# EAGLE design crystalis (EAGLE 7.3.0)
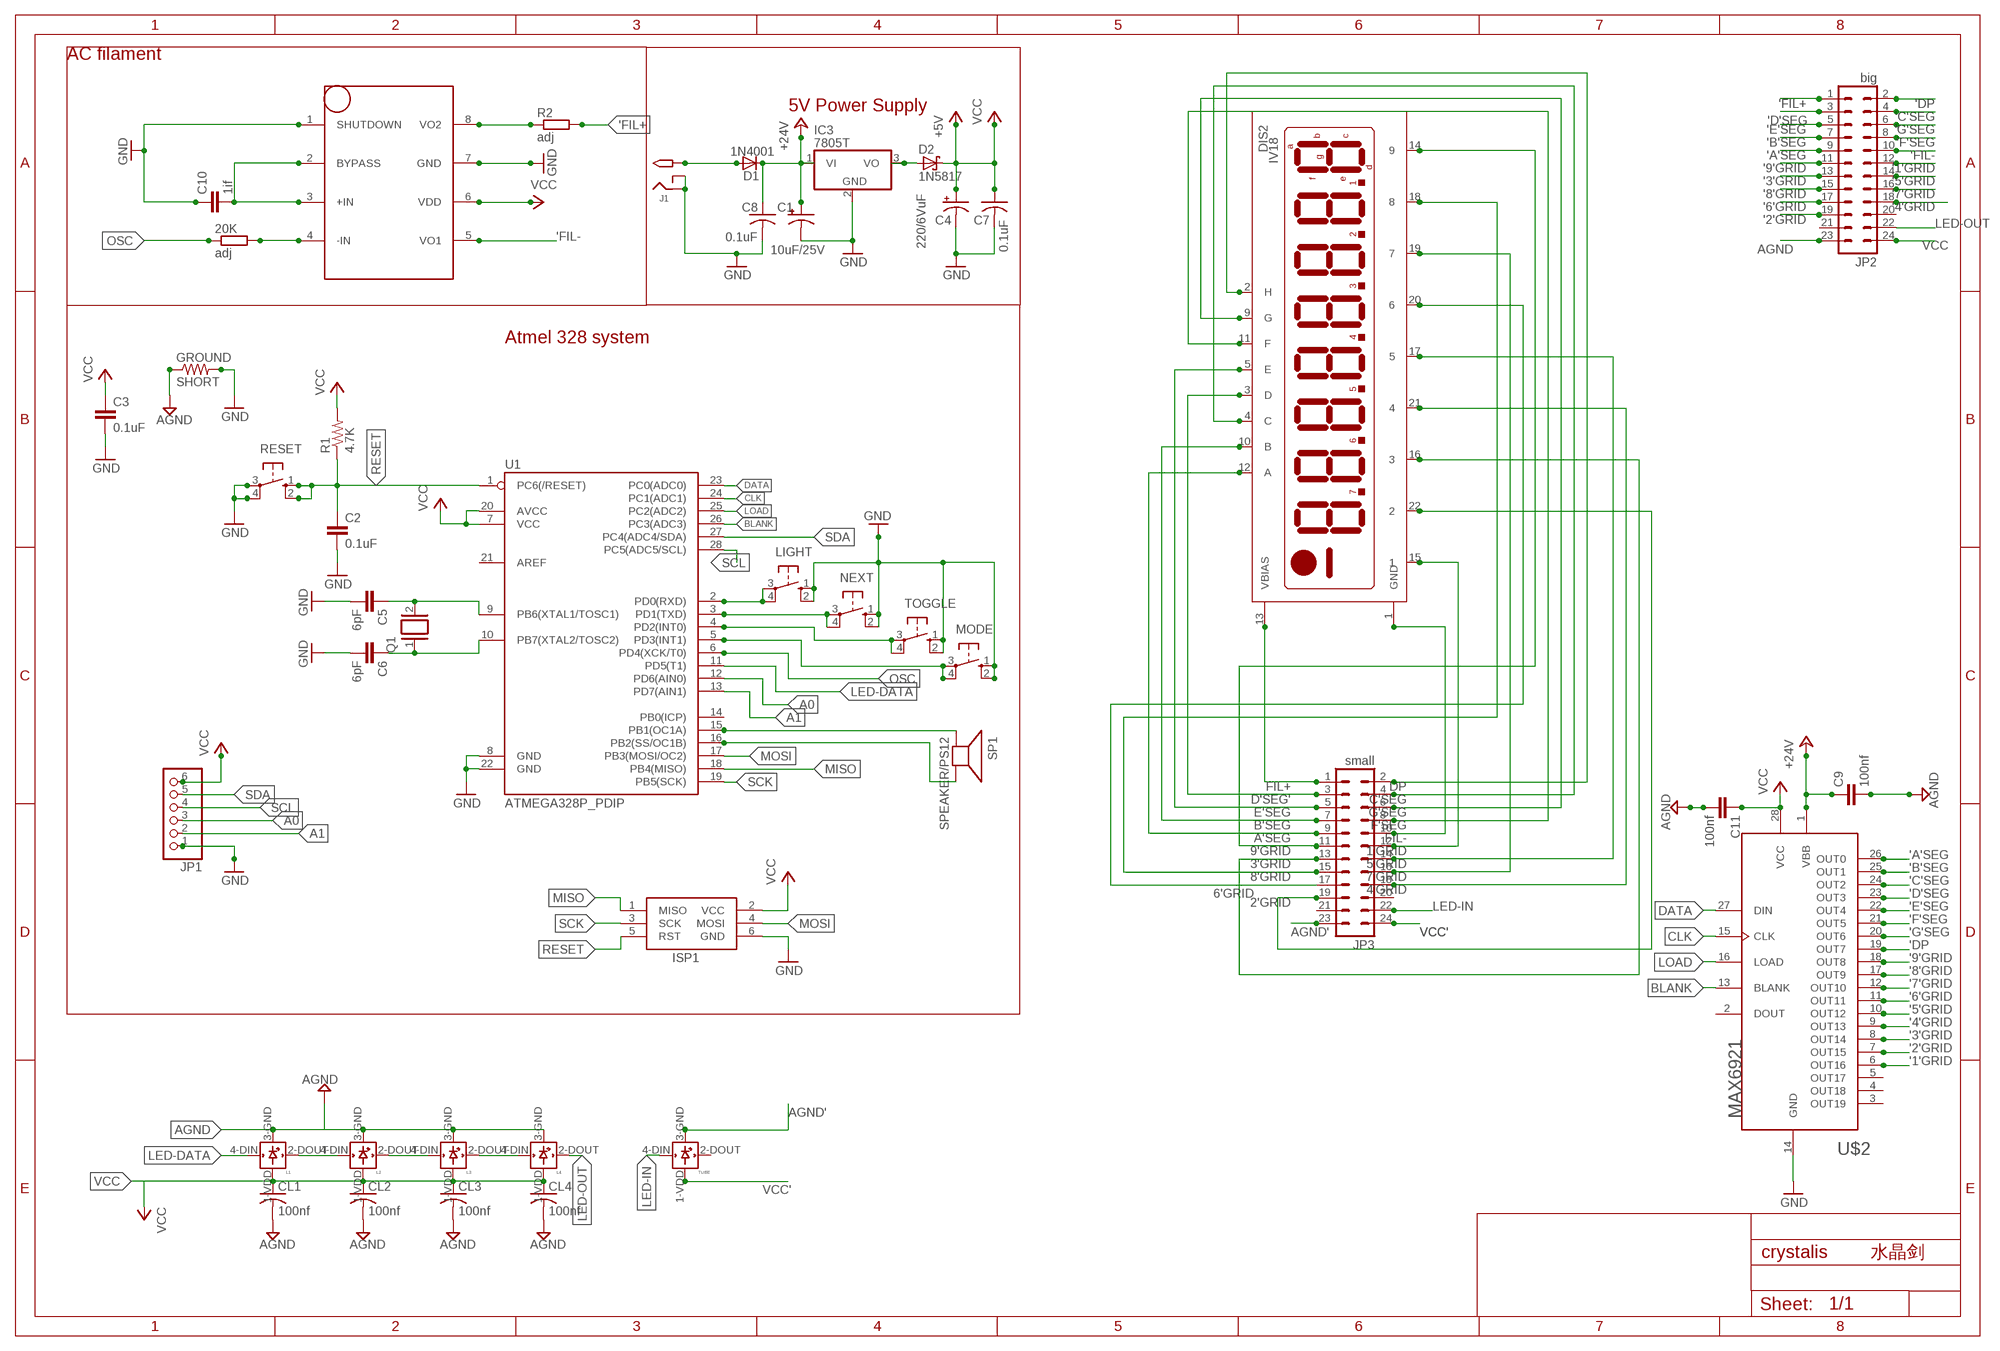
[diagram p0: schematic, sheet 1]

## Parts
20K  adj  R-EU_0207/5V  [0207/5V]
C1  10uF/25V  CPOL-USE2.5-6  [E2,5-6]
C2  0.1uF  C-EU025-025X050  [C025-025X050]
C3  0.1uF  C-EU025-025X050  [C025-025X050]
C4  220/6VuF  CPOL-USE2.5-6  [E2,5-6]
C5  6pF  C-EU025-024X044  [C025-024X044]
C6  6pF  C-EU025-024X044  [C025-024X044]
C7  0.1uF  C-US025-025X050  [C025-025X050]
C8  0.1uF  C-US025-025X050  [C025-025X050]
C9  100nf  C-EU050-030X075  [C050-030X075]
C10  1if  C-EU025-030X050  [C025-030X050]
C11  100nf  C-EU050-030X075  [C050-030X075]
CL1  100nf  C-USC1206  [C1206]
CL2  100nf  C-USC1206  [C1206]
CL3  100nf  C-USC1206  [C1206]
CL4  100nf  C-USC1206  [C1206]
D1  1N4001  1N4004  [DO41-10]
D2  1N5817  SCHOTTKY-DIODEDO41  [DO41-10]
DIS2  IV18  [IV18]
GROUND  SHORT  R-US_M1206  [M1206]
IC3  7805T  [TO220H]
ISP1  AVRISP-6  [AVRISP]
J1  2.1MMJACK  [PJ-102A]
JP1  PINHD-1X6  [1X06]
JP2  big  MA12-2  [MA12-2]
JP3  small  MA12-2  [MA12-2]
L1  WS2812B  [WS2812B]
L2  WS2812B  [WS2812B]
L3  WS2812B  [WS2812B]
L4  WS2812B  [WS2812B]
LIGHT  40-XX  [B3F-40XX]
MODE  40-XX  [B3F-40XX]
NEXT  40-XX  [B3F-40XX]
Q1  XTAL/S  [QS]
R1  4.7K  R-US_0309/12  [0309/12]
R2  adj  R-EU_0207/5V  [0207/5V]
RESET  10-XX  [B3F-10XX]
SP1  SPEAKER/PS12  [PS12]
TOGGLE  40-XX  [B3F-40XX]
TUBE  WS2812B  [WS2812B]
U1  ATMEGA328P_PDIP  [DIL28-3]
U$1  LM4871  [SO08]
U$2  MAX6921  [PLCC-S28]

## Nets
1'GRID: DIS2.15 JP3.12
2'GRID: DIS2.22 JP3.19
3'GRID: DIS2.16 JP3.13
4'GRID: DIS2.21 JP3.18
5'GRID: DIS2.17 JP3.14
6'GRID: DIS2.20 JP3.17
7'GRID: DIS2.19 JP3.16
8'GRID: DIS2.18 JP3.15
9'GRID: DIS2.14 JP3.11
'1'GRID: JP2.12 U$2.6(OUT16)
'2'GRID: JP2.19 U$2.7(OUT15)
'3'GRID: JP2.13 U$2.8(OUT14)
'4'GRID: JP2.18 U$2.9(OUT13)
'5'GRID: JP2.14 U$2.10(OUT12)
'6'GRID: JP2.17 U$2.11(OUT11)
'7'GRID: JP2.16 U$2.12(OUT10)
'8'GRID: JP2.15 U$2.17(OUT9)
'9'GRID: JP2.11 U$2.18(OUT8)
'A'SEG: JP2.9 U$2.26(OUT0)
'B'SEG: JP2.7 U$2.25(OUT1)
'C'SEG: JP2.4 U$2.24(OUT2)
'D'SEG: JP2.3 U$2.23(OUT3)
'DP: JP2.2 U$2.19(OUT7)
'E'SEG: JP2.5 U$2.22(OUT4)
'F'SEG: JP2.8 U$2.21(OUT5)
'FIL+: JP2.1 R2.2
'FIL-: JP2.10 U$1.5(VO1)
'G'SEG: JP2.6 U$2.20(OUT6)
+24V: C1.+ C8.1 C9.1 D1.C IC3.1(VI) U$2.1(VBB)
A0: JP1.3 U1.12(PD6(AIN0))
A1: JP1.2 U1.13(PD7(AIN1))
A'SEG: DIS2.12(A) JP3.9
AGND: C9.2 C11.2 CL1.2 CL2.2 CL3.2 CL4.2 GROUND.1 JP2.23 L1.3-GND(GND) L2.3-GND(GND) L3.3-GND(GND) L4.3-GND(GND)
AGND': JP3.23 TUBE.3-GND(GND)
B'SEG: DIS2.10(B) JP3.7
BLANK: U1.26(PC3(ADC3)) U$2.13(BLANK)
C'SEG: DIS2.4(C) JP3.4
CLK: U1.24(PC1(ADC1)) U$2.15(CLK)
D'SEG': DIS2.3(D) JP3.3
DATA: U1.23(PC0(ADC0)) U$2.27(DIN)
DP: DIS2.2(H) JP3.2
E'SEG: DIS2.5(E) JP3.5
F'SEG: DIS2.11(F) JP3.8
FIL+: DIS2.13(VBIAS) JP3.1
FIL-: DIS2.1(GND) JP3.10
G'SEG: DIS2.9(G) JP3.6
GND: C1.- C2.2 C3.2 C4.- C5.2 C6.2 C7.2 C8.2 C10.1 GROUND.2 IC3.2(GND) ISP1.6(GND) J1.RING J1.RING_SW JP1.1 LIGHT.1(S) LIGHT.2(S1) MODE.1(S) MODE.2(S1) NEXT.1(S) NEXT.2(S1) RESET.3(P) RESET.4(P1) TOGGLE.1(S) TOGGLE.2(S1) U1.8(GND) U1.22(GND) U$1.1(SHUTDOWN) U$1.7(GND) U$2.14(GND)
LED-DATA: L1.4-DIN(DIN) U1.11(PD5(T1))
LED-IN: JP3.22 TUBE.4-DIN(DIN)
LED-OUT: JP2.22 L4.2-DOUT(DOUT)
LOAD: U1.25(PC2(ADC2)) U$2.16(LOAD)
MISO: ISP1.1(MISO) U1.18(PB4(MISO))
MOSI: ISP1.4(MOSI) U1.17(PB3(MOSI/OC2))
N$2: MODE.3(P) MODE.4(P1) U1.5(PD3(INT1))
N$4: D1.A J1.TIP
N$5: 20K.2 U$1.4(-IN)
N$6: R2.1 U$1.8(VO2)
N$7: C10.2 U$1.2(BYPASS) U$1.3(+IN)
N$8: LIGHT.3(P) LIGHT.4(P1) U1.2(PD0(RXD))
N$9: C5.1 Q1.2 U1.9(PB6(XTAL1/TOSC1))
N$10: NEXT.3(P) NEXT.4(P1) U1.3(PD1(TXD))
N$11: TOGGLE.3(P) TOGGLE.4(P1) U1.4(PD2(INT0))
N$12: SP1.P$1(+) U1.15(PB1(OC1A))
N$13: C6.1 Q1.1 U1.10(PB7(XTAL2/TOSC2))
N$14: SP1.P$2(-) U1.16(PB2(SS/OC1B))
N$53: D2.A IC3.3(VO)
N$158: L1.2-DOUT(DOUT) L2.4-DIN(DIN)
N$179: L2.2-DOUT(DOUT) L3.4-DIN(DIN)
N$180: L3.2-DOUT(DOUT) L4.4-DIN(DIN)
OSC: 20K.1 U1.6(PD4(XCK/T0))
RESET: C2.1 ISP1.5(RST) R1.1 RESET.1(S) RESET.2(S1) U1.1(PC6(/RESET))
SCK: ISP1.3(SCK) U1.19(PB5(SCK))
SCL: JP1.4 U1.28(PC5(ADC5/SCL))
SDA: JP1.5 U1.27(PC4(ADC4/SDA))
VCC: C3.1 C4.+ C7.1 C11.1 CL1.1 CL2.1 CL3.1 CL4.1 D2.C ISP1.2(VCC) JP1.6 JP2.24 L1.1-VDD(VDD) L2.1-VDD(VDD) L3.1-VDD(VDD) L4.1-VDD(VDD) R1.2 U1.7(VCC) U1.20(AVCC) U$1.6(VDD) U$2.28(VCC) ; supply symbol labelled +5V
VCC': JP3.24 TUBE.1-VDD(VDD)
Unconnected: JP2.20 JP2.21 JP3.20 JP3.21 TUBE.2-DOUT(DOUT) U1.14(PB0(ICP)) U1.21(AREF) U$2.2(DOUT) U$2.3(OUT19) U$2.4(OUT18) U$2.5(OUT17)

## Notes on the sheet
- AC filament
- 5V Power Supply
- Atmel 328 system
- 水晶剑

## Library data of the parts
20K R2 = rcl:R-EU_: RESISTOR, European symbol
C1 C4 = minimidi:CPOL-US: POLARIZED CAPACITOR, American symbol
C2 C3 C5 C6 C9-C11 = rcl:C-EU: CAPACITOR, European symbol
C7 C8 = minimidi:C-US: CAPACITOR, American symbol
CL1-CL4 = rcl:C-US: CAPACITOR, American symbol
D1 = minimidi:1N4004: DIODE general purpose rectifier, 1 A
D2 = usbbuck:SCHOTTKY-DIODE: Schottky Diode
DIS2 = icetube:IV18: LCD DISPLAY 8-character 7 segment
GROUND R1 = rcl:R-US_: RESISTOR, American symbol
IC3 = linear:78*: Positive VOLTAGE REGULATOR
ISP1 = adafruit:AVRISP: AVR ISP HEADER Standard 6 pin header for AVR programming
J1 = minimidi:2.1MMJACK
JP1 = adafruit:PINHD-1X6: PIN HEADER
JP2 JP3 = con-lstb:MA12-2: PIN HEADER; OC_FARNELL: unknown; OC_NEWARK: unknown
L1-L4 TUBE = adafruit:WS2812B
LIGHT MODE NEXT TOGGLE = switch-omron:40-XX: OMRON SWITCH; MF: OMRON COMPONENTS USA; MPN: B3F-4000; OC_FARNELL: 176434; OC_NEWARK: 36K3105
Q1 = special:XTAL/S: CRYSTAL
RESET = switch-omron:10-XX: OMRON SWITCH; MPN: B3F-1000; OC_FARNELL: 176432; OC_NEWARK: 36M3542
SP1 = icetube:SPEAKER: SPEAKER Source: Buerklin
U1 = SparkFun-DigitalIC:ATMEGA328P_PDIP: uC used in the Arduino 32kb flash, 1k EEPROM, 2k SRAM This is the through-hole version of this chip.
U$1 = XXXXXXtube supl:LM4871
U$2 = icetube:MAX6921

## Board
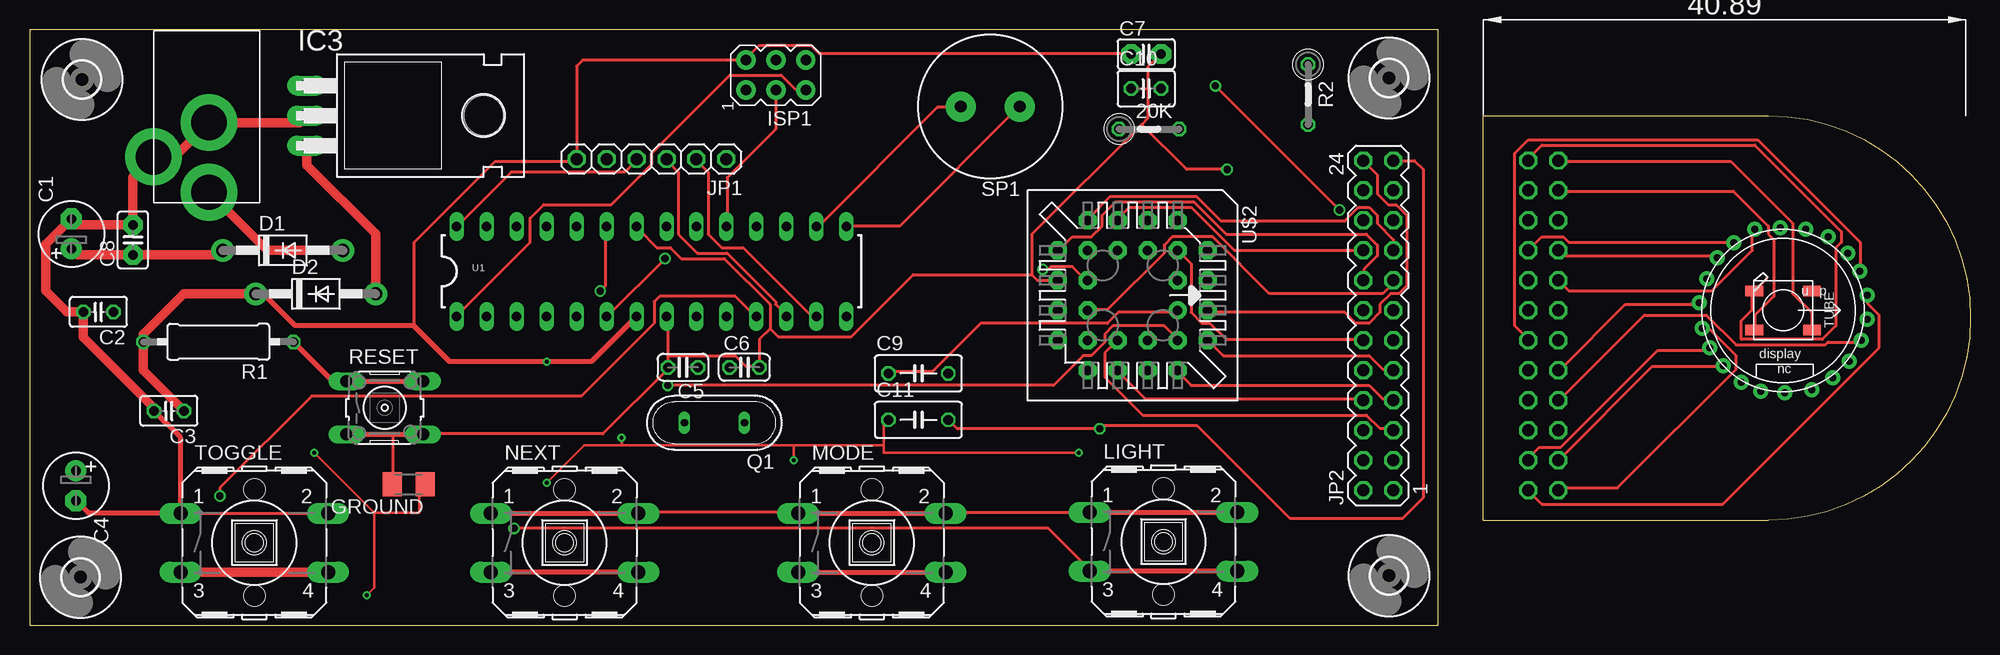
[diagram p1: board, top side]
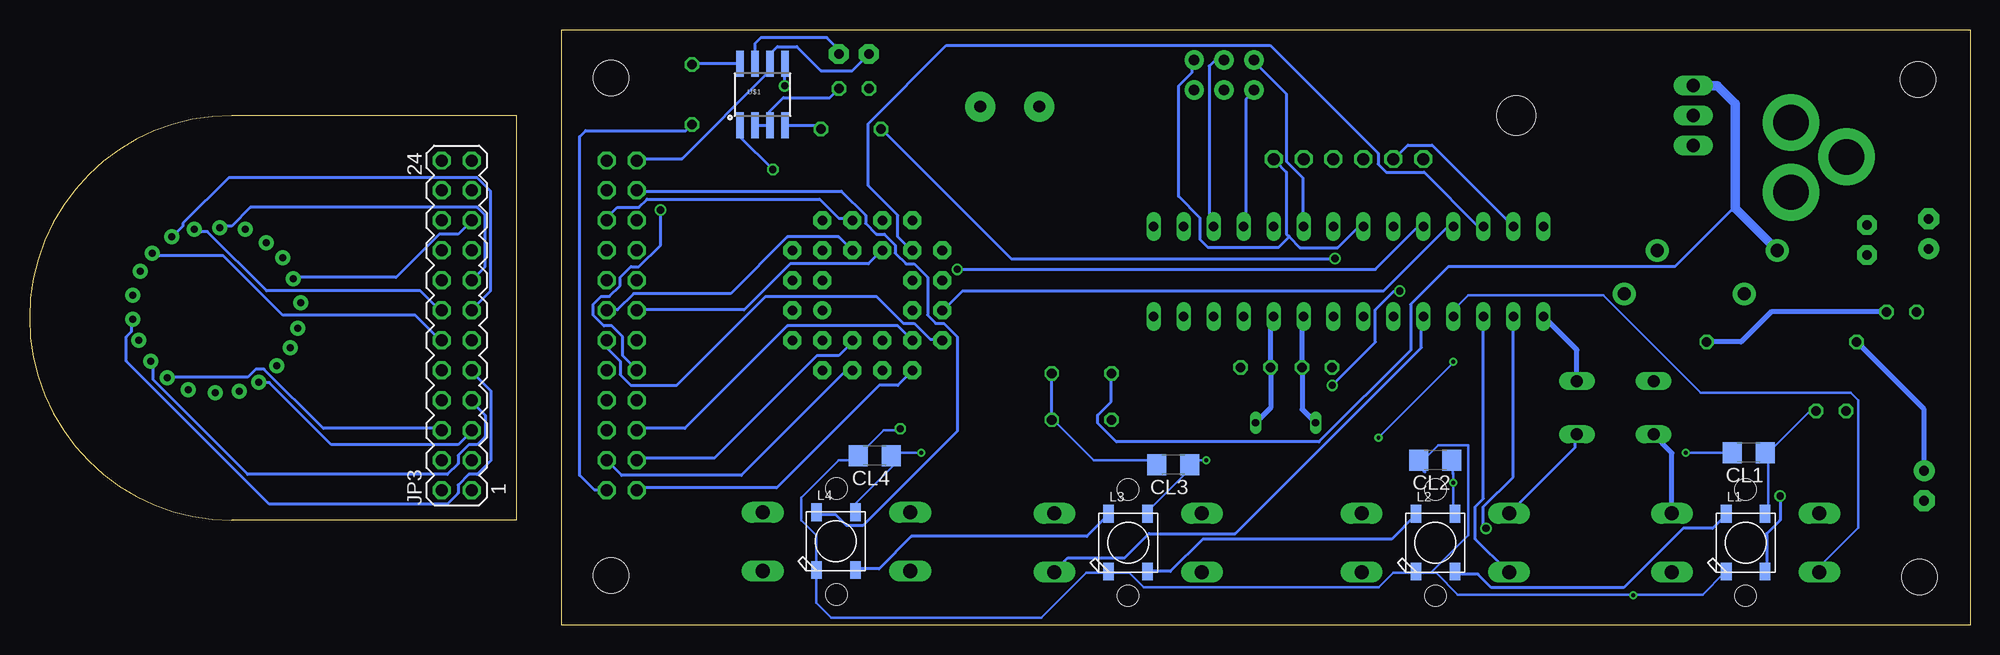
[diagram p2: board, bottom side, seen from below]

Size 164.47 x 50.47 mm. Coordinates in mm from the lower left corner, seen from the top.
Outline: 0,0 119.36,0 119.36,50.47 0,50.47 0,0
Outline: 123.19,8.89 123.19,43.18 147.32,43.18 arc-180 147.32,8.89 123.19,8.89
Copper layers (1*16): Top 0.0356mm / dielectric 1.5011mm / Bottom 0.0356mm
Design rules "ECE_Senior_Design": minimum track width 8mil, minimum drill 13mil, track to track 8mil, track to pad 8mil, pad to pad 6mil, via to via 8mil, smd to smd 6mil, copper to edge 15mil, drill to drill 8mil, minimum pad ring 7mil, minimum via ring 7mil, stop-mask expansion 3mil, vias tented up to drill 0mil, thermal gap 10mil

### Footprints (pad centres in the part's own frame; a part is rotated, then mirrored left to right if it is on the bottom)
0207/5V = drill 0.813 octagon: 1 -2.54,0; 2 2.54,0
E2,5-6 = drill 0.813 pad 1.778: + -1.27,0 | drill 0.813 pad 1.778 octagon: - 1.27,0
C025-025X050 = drill 0.813 octagon: 1 -1.27,0; 2 1.27,0
C025-024X044 = drill 0.813 octagon: 1 -1.27,0; 2 1.27,0
C025-025X050' = drill 0.813 pad 1.676 octagon: 1 -1.27,0; 2 1.27,0
C050-030X075 = drill 0.813 octagon: 1 -2.54,0; 2 2.54,0
C025-030X050 = drill 0.813 octagon: 1 -1.27,0; 2 1.27,0
C1206 = smd 1.6 x 1.8: 1 -1.4,0; 2 1.4,0
DO41-10 = drill 1.118 pad 1.93: A 5.08,0; C -5.08,0
IV18 = drill 0.6 pad 1.27: 1 -0.635,-7.112; 2 1.524,-6.858; 3 3.175,-6.223; 4 4.699,-5.08; 5 6.096,-3.556; 6 6.858,-1.905; 7 6.985,0.127; 8 6.731,2.413; 9 5.715,4.191; 10 4.318,5.588; 11 2.54,6.604; 12 0.762,7.112; 13 -1.27,7.112; 14 -3.302,6.477; 15 -4.826,5.461; 16 -6.223,3.81; 17 -6.858,1.905; 18 -6.985,-0.254; 19 -6.858,-2.413; 20 -5.715,-4.191; 21 -4.445,-5.588; 22 -2.667,-6.477
M1206 = smd 1.6 x 2: 1 -1.4,0; 2 1.4,0
TO220H = drill 1.118 long: 1 -2.54,-10.16; 2 0,-10.16; 3 2.54,-10.16 | hole 3.302: 0,4.826
AVRISP = drill 0.9 pad 1.626: 1 -1.27,2.54; 2 1.27,2.54; 3 -1.27,0; 4 1.27,0; 5 -1.27,-2.54; 6 1.27,-2.54
PJ-102A = drill 3 pad 4.8: RING 0.1,-3.39; RING_SW -4.6,-6.29; TIP 0.1,-9.29
1X06 = drill 1.016 octagon: 1 -6.35,0; 2 -3.81,0; 3 -1.27,0; 4 1.27,0; 5 3.81,0; 6 6.35,0
MA12-2 = drill 1.016 octagon: 1 -13.97,-1.27; 2 -13.97,1.27; 3 -11.43,-1.27; 4 -11.43,1.27; 5 -8.89,-1.27; 6 -8.89,1.27; 7 -6.35,-1.27; 8 -6.35,1.27; 9 -3.81,-1.27; 10 -3.81,1.27; 11 -1.27,-1.27; 12 -1.27,1.27; 13 1.27,-1.27; 14 1.27,1.27; 15 3.81,-1.27; 16 3.81,1.27; 17 6.35,-1.27; 18 6.35,1.27; 19 8.89,-1.27; 20 8.89,1.27; 21 11.43,-1.27; 22 11.43,1.27; 23 13.97,-1.27; 24 13.97,1.27
WS2812B = smd 1.5 x 0.9: 1-VDD 2.45,-1.65; 2-DOUT 2.45,1.65; 3-GND -2.45,1.65; 4-DIN -2.45,-1.65
B3F-40XX = drill 1.194 long: 1 -6.248,2.489; 2 6.248,2.489; 3 -6.248,-2.489; 4 6.248,-2.489 | hole 1.803: 0,-4.496; 0,4.496
QS = drill 0.61 long: 1 -2.54,0; 2 2.54,0
0309/12 = drill 0.813 octagon: 1 -6.35,0; 2 6.35,0
B3F-10XX = drill 1.016 long: 1 -3.251,2.261; 2 3.251,2.261; 3 -3.251,-2.261; 4 3.251,-2.261
PS12 = drill 1 pad 2.54: P$1 -2.5,0; P$2 2.5,0
DIL28-3 = drill 0.813 long: 1 -16.51,-3.81; 2 -13.97,-3.81; 3 -11.43,-3.81; 4 -8.89,-3.81; 5 -6.35,-3.81; 6 -3.81,-3.81; 7 -1.27,-3.81; 8 1.27,-3.81; 9 3.81,-3.81; 10 6.35,-3.81; 11 8.89,-3.81; 12 11.43,-3.81; 13 13.97,-3.81; 14 16.51,-3.81; 15 16.51,3.81; 16 13.97,3.81; 17 11.43,3.81; 18 8.89,3.81; 19 6.35,3.81; 20 3.81,3.81; 21 1.27,3.81; 22 -1.27,3.81; 23 -3.81,3.81; 24 -6.35,3.81; 25 -8.89,3.81; 26 -11.43,3.81; 27 -13.97,3.81; 28 -16.51,3.81
SO08 = smd 0.61 x 2.21: 1 -1.905,-2.616; 2 -0.635,-2.616; 3 0.635,-2.616; 4 1.905,-2.616; 5 1.905,2.616; 6 0.635,2.616; 7 -0.635,2.616; 8 -1.905,2.616
PLCC-S28 = drill 0.813 pad 1.524: 1 1.27,3.81 | drill 0.813 pad 1.524 octagon: 2 -1.27,6.35; 3 -1.27,3.81; 4 -3.81,6.35; 5 -6.35,3.81; 6 -3.81,3.81; 7 -6.35,1.27; 8 -3.81,1.27; 9 -6.35,-1.27; 10 -3.81,-1.27; 11 -6.35,-3.81; 12 -3.81,-6.35; 13 -3.81,-3.81; 14 -1.27,-6.35; 15 -1.27,-3.81; 16 1.27,-6.35; 17 1.27,-3.81; 18 3.81,-6.35; 19 6.35,-3.81; 20 3.81,-3.81; 21 6.35,-1.27; 22 3.81,-1.27; 23 6.35,1.27; 24 3.81,1.27; 25 6.35,3.81; 26 3.81,6.35; 27 3.81,3.81; 28 1.27,6.35
3,0 = hole 3: 0,0

### Placement (x,y rotation side)
20K  94.87,42.04 0 top
C1  3.56,33.15 90 top
C2  5.84,26.54 180 top
C3  11.81,18.16 180 top
C4  3.94,11.81 270 top
C5  55.37,21.84 180 top
C6  60.58,21.84 0 top
C7  0.1uF  [C025-025X050']  94.61,48.39 0 top
C8  0.1uF  [C025-025X050']  8.76,32.64 90 top
C9  75.31,21.34 0 top
C10  94.61,45.47 0 top
C11  75.31,17.4 0 top
CL1  18.8,14.61 180 bottom
CL2  45.34,13.97 180 bottom
CL3  67.56,13.59 180 bottom
CL4  92.84,14.35 180 bottom
D1  21.46,31.75 0 top
D2  24.26,28.07 0 top
DIS2  148.59,26.67 270 top
GROUND  32.13,11.94 180 top
IC3  33.66,43.18 270 top
ISP1  63.25,46.61 90 top
J1  15.11,45.97 0 top
JP1  52.7,39.5 180 top
JP2  114.3,25.4 90 top
JP3  128.27,25.4 90 bottom
L1  19.05,6.99 90 bottom
L2  45.34,6.99 90 bottom
L3  71.37,6.99 90 bottom
L4  96.14,7.11 90 bottom
LIGHT  96.09,7.07 0 top
MODE  71.37,6.99 0 top
NEXT  45.34,6.99 0 top
Q1  58.04,17.15 180 top
R1  16,24 180 top
R2  108.33,44.96 270 top
RESET  30.1,18.41 0 top
SP1  81.41,43.94 180 top
TOGGLE  19.05,6.99 0 top
TUBE  148.59,26.67 0 top
U1  52.7,29.97 0 top
U$1  102.36,44.96 0 bottom
U$2  93.47,27.94 270 top
U$3  [3,0]  4.45,46.23 0 top
U$4  [3,0]  115.19,46.36 0 top
U$5  [3,0]  115.19,4.19 0 top
U$6  [3,0]  4.32,4.06 0 top

### Tracks (layer width: path | path; a pad name or v marks a point on that pad's centre or on a via)
1'GRID
  Bottom 0.254: DIS2.15 153.97,31.29 148.03,31.29 143,26.26 131.8,26.26 129.74,24.21 JP3.12
2'GRID
  Bottom 0.254: DIS2.22 142.09,29.46 133.4,29.46 129.74,33.12 128.14,33.12 127,34.27 JP3.19
3'GRID
  Bottom 0.254: DIS2.16 152.38,32.89 151.46,33.81 151.46,34.04 147.57,37.92 126.54,37.92 125.4,36.78 125.4,28.32 127,26.72 JP3.13
4'GRID
  Top 0.254: DIS2.21 143,31.29 130.2,31.29 129.74,31.75 JP3.18
5'GRID
  Bottom 0.254: DIS2.17 150.32,33.35 149.4,33.35 144.37,28.32 131.34,28.32 129.74,26.72 JP3.14
6'GRID
  Top 0.254: JP3.17 128.14,32.89 129.97,32.89 130.43,32.44 144.37,32.44 DIS2.20
7'GRID
  Top 0.254: JP3.16 130.43,28.32 142.54,28.32 145.97,31.75 145.97,33.35 DIS2.19
8'GRID
  Bottom 0.254: DIS2.18 148.26,33.81 147.34,33.81 145.75,35.41 126.54,35.41 125.86,34.72 125.86,30.38 127,29.23 JP3.15
9'GRID
  Top 0.254: DIS2.14 155.12,30.15 155.12,32.44 146.43,41.12 127,41.12 125.86,39.98 125.86,25.35 127,24.21 JP3.11
'1'GRID
  Top 0.254: U$2.6 98.42,30.61 98.42,26.49 99.34,25.58 100.02,25.58 101.4,24.21 112.83,24.21 JP2.12
'2'GRID
  Bottom 0.254: U$2.7 94.77,34.49 95.91,34.49 97.51,36.09 112.14,36.09 112.83,35.41 114.66,35.41 115.57,34.49 JP2.19
'3'GRID
  Bottom 0.254: JP2.13 115.57,26.72 114.66,26.72 113.28,28.09 105.05,28.09 100.25,32.89 95.91,32.89 94.77,31.75 U$2.8
'4'GRID
  Top 0.254: JP2.18 102.08,31.75 98.42,35.41 93.17,35.41 92.25,34.49 U$2.9
'5'GRID
  Bottom 0.254: JP2.14 112.83,26.72 103.91,26.72 100.02,30.61 93.4,30.61 92.25,31.75 U$2.10
'6'GRID
  Top 0.254: JP2.17 115.57,32.66 114.2,34.04 114.2,34.72 113.51,35.41 112.6,35.41 111.45,34.27 100.94,34.27 98.88,36.32 91.57,36.32 89.74,34.49 U$2.11
'7'GRID
  Top 0.254: JP2.16 113.06,29.23 113.06,30.15 114.2,31.29 114.2,32.21 113.28,33.12 101.4,33.12 98.65,35.87 92.02,35.87 90.88,34.72 90.88,33.81 89.97,32.89 88.37,32.89 87.22,31.75 U$2.12
'8'GRID
  Top 0.254: U$2.17 89.74,26.72 91.34,26.72 96.14,31.52 96.14,32.21 96.83,32.89 100.25,32.89 105.05,28.09 114.66,28.09 115.57,29.01 JP2.15
'9'GRID
  Bottom 0.254: JP2.11 115.57,23.52 114.43,22.38 114.43,21.23 113.51,20.32 109.63,20.32 102.08,27.86 92.71,27.86 90.42,25.58 89.51,25.58 88.14,24.21 87.22,24.21 U$2.18
'A'SEG
  Top 0.254: JP2.9 115.57,21.69 114.66,21.69 113.51,22.84 101.17,22.84 100.02,23.98 U$2.26
'B'SEG
  Top 0.254: JP2.7 115.57,19.18 114.66,19.18 113.51,20.32 98.42,20.32 97.28,21.46 U$2.25
'C'SEG
  Bottom 0.254: JP2.4 112.83,14.15 106.43,14.15 97.74,22.84 95.91,22.84 94.77,23.98 U$2.24
'D'SEG
  Bottom 0.254: U$2.23 95.25,21.59 104.14,12.7 114.3,12.7 JP2.3
'DP
  Bottom 0.254: JP2.2 112.83,11.63 101.17,11.63 92.48,20.32 90.88,20.32 89.74,21.46 U$2.19
'E'SEG
  Top 0.254: JP2.5 115.57,16.66 114.43,16.66 113.28,17.8 94.31,17.8 91.11,21.01 91.11,23.06 92.02,23.98 U$2.22
'F'SEG
  Top 0.254: JP2.8 112.83,19.18 94.54,19.18 92.25,21.46 U$2.21
'FIL+
  Bottom 0.254: JP2.1 116.59,11.43 117.86,12.7 117.86,41.4 117.35,41.91 108.84,41.91 R2.2
'FIL-  (via drill 0.61)
  Top 0.254: v111,35.18 v100.48,45.7
  Bottom 0.254: v100.48,45.7 100.48,47.52 U$1.5 | v111,35.18 111,32.21 112.83,30.38 113.51,30.38 114.43,29.46 114.43,28.78 115.34,27.86 116.03,27.86 116.71,27.18 116.71,26.26 115.8,25.35 115.11,25.35 114.2,24.44 114.2,22.84 113.06,21.69 JP2.10
'G'SEG
  Bottom 0.254: U$2.20 90.88,25.35 100.25,25.35 108.94,16.66 112.83,16.66 JP2.6
+24V
  Top 0.254: C9.1 72.82,21.46 76.48,21.46 80.59,25.58 91.34,25.58 92.25,26.49 97.28,26.49 U$2.1
  Top 0.813: C1.+ 4.06,31.37 C8.1 16,31.37 D1.C
  Bottom 0.254: C9.1 72.82,21.23 72.82,18.95 73.97,17.8 73.97,17.12 72.36,15.52 55.22,15.52 47.45,23.29 47.45,27.18 44.25,30.38 25.04,30.38 20.24,35.18 19.94,35.31
  Bottom 0.813: IC3.1 21.46,45.72 19.94,44.2 19.94,35.31 D1.C
A0
  Top 0.254: U1.12 64.13,26.26 63.22,27.18 63.22,27.41 59.11,31.52 56.59,31.52 54.99,33.12 54.99,38.38 54.08,39.29 JP1.3
A1
  Top 0.254: U1.13 66.65,26.26 66.19,26.26 60.48,31.98 58.65,31.98 57.51,33.12 57.51,38.38 56.59,39.29 JP1.2
A'SEG
  Bottom 0.254: DIS2.12 155.8,25.81 155.8,24.89 156.26,24.44 156.26,22.38 144.15,10.26 129.06,10.26 128.14,11.18 128.14,11.86 127.23,12.78 126.54,12.78 125.4,13.92 125.4,19.86 127,21.46 JP3.9
AGND  (via drill 0.33, 0.6)
  Top 0.203: 29.21,9.53 v24.13,14.61 | 29.21,9.53 33.02,9.53 33.02,11.43 GROUND.1 | v28.57,2.54 29.21,3.18 29.21,9.53
  Top 0.254: C11.2 78.61,16.64 v90.68,16.64 90.93,16.89 98.93,16.89 106.81,9.02 116.33,9.02 118.11,10.79 118.11,38.61 117.35,39.37 JP2.23
  Bottom 0.203: 45.72,4.42 45.26,4.42 43.43,2.59 28.57,2.59 | 45.72,4.42 46.89,4.42 L2.3-GND 47.09,4.42 48.92,4.42 50.14,3.2 70.05,3.2 71.27,4.42 72.9,4.42 L3.3-GND 73.02,4.45 74.93,4.45 78.74,0.63 96.52,0.63 97.79,1.91 97.79,4.45 L4.3-GND 97.79,5.08 97.79,7.62 99.06,8.89 99.06,10.79 95.88,13.97 94.61,13.97 CL4.2 93.98,14.61 92.08,16.51 90.8,16.51 v90.68,16.64 | 28.57,2.59 22.71,2.59 20.88,4.42 L1.3-GND | CL2.2 46.35,13.97 45.08,15.24 42.55,15.24 42.55,7.62 45.72,4.45 45.72,4.42 | v24.13,14.61 CL1.2 | v28.57,2.54 28.57,2.59 | CL3.2 69.22,13.97 74.3,13.97 77.47,17.15 C11.2
  Bottom 0.254: C11.2 C9.2 | 46.23,12.96 CL2.2
AGND'
  Top 0.254: 147.19,29.37 TUBE.3-GND 145.97,28.09 145.97,26.72 145.06,25.81 145.06,24.21 151.92,24.21 153.06,25.35 153.06,31.98 153.52,32.44 153.52,33.35 146.2,40.66 128.14,40.66 127,39.52 JP3.23
B'SEG
  Bottom 0.254: DIS2.10 153.97,22.15 153.97,20.78 145.97,12.78 129.06,12.78 128.14,13.69 128.14,14.38 127.23,15.29 126.54,15.29 125.86,15.98 125.86,17.8 127,18.95 JP3.7
BLANK
  Bottom 0.254: U1.26 41.28,33.81 41.73,33.81 46.3,38.38 49.5,38.38 50.19,39.06 50.19,39.98 59.33,49.12 86.77,49.12 93.4,42.49 93.4,37.24 90.88,34.72 90.88,32.89 89.74,31.75 U$2.13
C'SEG
  Top 0.254: DIS2.4 143.46,21.92 137.52,21.92 129.74,14.15 JP3.4
CLK  (via drill 0.61)
  Top 0.254: v85.85,30.15 86.31,30.15 86.54,30.38 88.37,30.38 89.51,29.23 U$2.15
  Bottom 0.254: v85.85,30.15 50.42,30.15 46.99,33.58 46.53,33.58 U1.24
D'SEG'
  Top 0.254: DIS2.3 142.32,23.29 137.97,23.29 129.74,15.06 127.91,15.06 127,14.15 JP3.3
DATA  (via drill 0.61)
  Top 0.254: v48.36,28.32 48.82,28.78 48.82,33.58 U1.23 | v54.08,20.32 86.77,20.32 89.28,22.84 89.97,22.84 91.11,23.98 91.11,24.66 91.8,25.35 96.14,25.35 97.28,24.21 U$2.27
  Bottom 0.254: v48.36,28.32 48.82,28.32 50.42,26.72 50.42,23.98 v54.08,20.32
DP
  Top 0.254: DIS2.2 141.86,25.12 142.32,25.12 144.6,22.84 144.6,21.69 134.54,11.63 129.74,11.63 JP3.2
E'SEG
  Bottom 0.254: DIS2.5 144.83,20.55 144.15,20.55 138.89,15.29 128.14,15.29 127,16.43 JP3.5
F'SEG
  Top 0.254: DIS2.11 155.12,23.98 152.38,23.98 152.15,23.75 144.6,23.75 142.09,26.26 136.83,26.26 129.74,19.18 JP3.8
FIL+
  Top 0.254: DIS2.13 155.8,27.86 155.8,27.18 156.72,26.26 156.72,23.52 143.46,10.26 128.14,10.26 127,11.41 JP3.1
FIL-
  Top 0.254: DIS2.1 141.4,27.18 135.23,27.18 129.74,21.69 JP3.10
G'SEG
  Bottom 0.254: DIS2.9 152.6,21.01 145.97,21.01 145.29,21.69 144.6,21.69 139.57,16.66 129.74,16.66 JP3.6
GND  (via drill 0.6)
  Top 0.203: C10.1 94.77,45.47 94.84,45.47
  Top 0.254: TOGGLE.1 TOGGLE.2 | 30.76,16.15 30.76,12.09 GROUND.2 | NEXT.2 51.79,9.58 65.05,9.58 MODE.1 | LIGHT.1 89.74,9.58 77.62,9.58 MODE.2 | 84.94,29.69 85.39,29.23 86.99,29.23 U$2.14 | 84.94,29.69 84.94,33.12 94.23,42.42 | 94.23,42.42 94.77,42.95 94.77,45.47 94.77,47.3 95.68,48.21 C7.2 | 54.08,22.84 54.08,26.04 U1.8 | 54.08,22.84 54.08,21.92 C5.2 54.08,21.69 48.59,16.21 33.5,16.21 RESET.4 | 61.85,21.92 60.71,21.92 59.79,22.84 54.08,22.84 | 61.85,21.92 61.85,24.21 62.76,25.12 | 62.76,25.12 62.76,27.18 58.88,31.06 55.22,31.06 54.3,31.98 53.16,31.98 51.56,33.58 U1.22 | 61.85,21.92 C6.2 | 84.94,29.69 74.88,29.69 69.62,24.44 63.45,24.44 62.76,25.12 | v101.47,38.61 98.04,38.61 94.23,42.42
  Top 0.406: NEXT.1 NEXT.2 | MODE.1 MODE.2 | LIGHT.1 LIGHT.2 | C3.2 12.8,15.9 TOGGLE.1 5,9.47 C4.- | RESET.3 30.76,16.15 RESET.4
  Top 0.813: IC3.2 22.9,42.58 J1.RING 12.31,39.68 J1.RING_SW 8.76,37.93 C8.2 4.06,33.91 C1.- 1.4,32.26 1.4,28.32 3.18,26.54 C2.2 4.57,24.38 10.54,18.41 C3.2
  Bottom 0.254: C7.2 95.88,48.77 96.9,49.78 102.49,49.78 103,49.28 U$1.7 | NEXT.1 33.5,15.06 33.5,15.98 RESET.4 | 57.73,32.89 57.96,33.12 57.96,38.38 58.88,39.29 JP1.1 | 57.73,32.89 56.82,31.98 53.62,31.98 52.02,33.58 51.56,33.58 U1.22 | 57.73,32.89 58.65,31.98 64.59,31.98 65.28,32.66 65.28,34.49 67.11,36.32 67.11,45.7 65.96,46.84 65.96,47.75 ISP1.6 | U$1.1 104.27,41.4 v101.47,38.61
  Bottom 0.406: TOGGLE.2 25.3,14.61 RESET.3
LED-DATA  (via drill 0.61)
  Top 0.254: v16.13,10.95 16.13,11.63 23.9,19.41 46.76,19.41 52.93,25.58 52.93,27.41 53.39,27.86 59.79,27.86 61.39,26.26 U1.11
  Bottom 0.254: v16.13,10.95 16.13,8.89 17.27,7.75 17.27,4.55 L1.4-DIN
LED-IN
  Top 0.254: TUBE.4-DIN 146.2,25.12 146.2,26.26 147.8,27.86 147.8,32.66 147.34,33.12 147.34,33.81 144.37,36.78 129.74,36.78 JP3.22
LED-OUT
  Bottom 0.254: L4.2-DOUT 97.74,9.35 96.14,9.35 95.22,8.43 93.85,8.43 85.85,16.43 85.85,24.44 86.99,25.58 87.68,25.58 88.37,26.26 88.37,29.46 89.51,30.61 90.19,30.61 91.11,31.52 91.11,32.21 92.02,33.12 92.71,33.12 93.62,34.04 93.62,34.72 95.68,36.78 112.83,36.78 JP2.22
LOAD
  Bottom 0.254: U1.25 44.02,33.58 44.47,33.58 49.73,28.32 85.39,28.32 86.99,26.72 U$2.16
MISO
  Bottom 0.254: U1.18 61.39,33.81 61.39,44.55 60.71,45.24 ISP1.1
MOSI
  Bottom 0.254: ISP1.4 64.01,47.88 64.52,47.37 64.52,34.16 U1.17
N$2
  Top 0.406: MODE.3 MODE.4
  Bottom 0.254: U1.5 46.53,26.04 46.53,23.52 62.31,7.75 69.62,7.75 71.68,5.69 76.48,5.69 77.62,4.55 MODE.4
N$4
  Top 0.813: D1.A 20.15,31.75 J1.TIP
N$5
  Bottom 0.254: U$1.4 97.71,42.34 20K.2
N$6
  Bottom 0.254: U$1.8 108.25,47.57 R2.1
N$7
  Bottom 0.254: C10.2 96.65,44.7 100.58,44.7 101.73,43.56 U$1.3 U$1.2
N$8  (via drill 0.61)
  Top 0.254: v41.05,8.2 86.31,8.2 89.74,4.78 LIGHT.3
  Top 0.406: LIGHT.4 LIGHT.3
  Bottom 0.254: v41.05,8.2 41.28,8.43 41.28,10.03 38.76,12.55 38.76,26.04 U1.2
N$9
  Bottom 0.406: Q1.2 56.64,18.29 C5.1 56.64,26.04 U1.9
N$10
  Top 0.406: NEXT.4 NEXT.3
  Bottom 0.254: U1.3 41.28,10.72 41.96,10.03 41.96,7.29 39.22,4.55 NEXT.3
N$11
  Top 0.813: TOGGLE.4 TOGGLE.3
  Bottom 0.203: U1.4 43.81,26.67 42.55,27.94 31.11,27.94 22.86,19.69 10.16,19.69 9.52,19.05 9.52,8.26 12.7,5.08 TOGGLE.3
N$12
  Top 0.254: U1.15 69.39,33.81 73.74,33.81 83.8,43.87 SP1.P$1
N$13
  Bottom 0.406: Q1.1 59.31,18.41 C6.1 59.31,25.91 U1.10
N$14
  Top 0.254: U1.16 66.88,33.81 76.94,43.87 78.77,43.87 SP1.P$2
N$53
  Top 0.813: D2.A 29.34,33.15 23.5,38.99 IC3.3
N$158
  Bottom 0.254: L2.4-DIN 43.56,4.32 41.73,4.32 40.59,3.18 29.39,3.18 24.36,8.2 21.84,8.2 20.7,9.35 L1.2-DOUT
N$179
  Bottom 0.254: L3.4-DIN 69.62,4.55 67.79,4.55 65.05,7.29 49.05,7.29 46.99,9.35 L2.2-DOUT
N$180
  Bottom 0.254: L4.4-DIN 94.31,4.78 92.48,4.78 89.74,7.52 74.88,7.52 73.05,9.35 L3.2-DOUT
OSC  (via drill 0.61)
  Top 0.254: v53.85,31.06 49.05,26.26 U1.6
  Bottom 0.254: v53.85,31.06 81.28,31.06 92.25,42.04 20K.1
RESET
  Top 0.254: ISP1.5 65.73,45.47 64.82,45.47 63.68,46.61 59.33,46.61 52.7,39.98 52.7,39.06 49.28,35.64 43.56,35.64 42.42,34.49 42.42,32.44 36.25,26.26 U1.1
  Top 0.406: R1.1 25.68,20.68 RESET.1 RESET.2
  Bottom 0.406: C2.1 16.89,26.54 19.43,24 R1.1 | RESET.2 33.35,23.32 U1.1
SCK
  Top 0.254: U1.19 59.11,33.81 59.11,37.92 63.22,42.04 63.22,45.24 ISP1.3
SCL
  Top 0.254: U1.28 36.25,33.81 40.82,38.38 50.42,38.38 51.33,39.29 JP1.4
SDA
  Bottom 0.254: U1.27 45.62,40.66 47.68,40.66 48.82,39.52 JP1.5
VCC  (via drill 0.33)
  Top 0.203: v43.84,22.3 43.84,22.35 | v43.81,12.07 46.99,15.24 50.16,15.24 | 72.39,15.24 64.77,15.24 | 64.77,15.24 50.16,15.24 | 72.39,15.24 72.39,17.15 C11.1 | 64.77,15.24 v64.77,13.97 | v88.9,14.61 72.39,14.61 72.39,15.24 | 50.16,15.24 v50.16,15.88
  Top 0.254: U$2.28 100.02,26.49 111.45,26.49 112.37,25.58 113.51,25.58 114.43,26.49 114.43,27.18 115.34,28.09 116.03,28.09 116.71,28.78 116.71,34.72 115.8,35.64 115.11,35.64 114.2,36.55 114.2,38.15 113.06,39.29 JP2.24 | 32.51,25.4 32.59,25.58 32.59,32.44 39.45,39.29 46.3,39.29 JP1.6 46.35,47.37 46.86,47.88 ISP1.2 60.71,47.98 61.85,49.12 66.19,49.12 66.88,48.44 93.17,48.44 C7.1
  Top 0.406: D2.C 19.81,28.07 22.48,25.4 32.51,25.4 35.56,22.35 43.84,22.35 47.62,22.35 U1.7
  Top 0.813: C3.1 9.65,21.59 R1.2 9.65,24.64 13.08,28.07 D2.C
  Bottom 0.203: 69.85,9.5 L3.1-VDD 69.85,9.53 66.04,13.34 CL3.1 66.04,13.97 v64.77,13.97 | 43.84,9.5 L2.1-VDD 43.81,9.53 v43.81,12.07 43.81,12.7 43.84,12.75 CL2.1 43.84,12.55 | 17.14,14.61 17.14,9.53 L1.1-VDD | 17.14,14.61 13.33,18.41 C3.1 | 17.14,14.61 CL1.1 | L4.1-VDD 94.61,10.16 90.8,13.97 CL4.1 90.8,14.61 v88.9,14.61 | v50.16,15.88 43.81,22.23 v43.84,22.3
  Bottom 0.254: C7.1 94.74,46.99 97.41,46.99 99.44,49.02 101.09,49.02 101.73,48.39 U$1.6 101.85,47.52 101.85,46.84 109.17,39.52 112.83,39.52 JP2.24 | U1.20 56.59,33.81 56.59,37.92 57.96,39.29 57.96,45.01 60.71,47.75 ISP1.2
  Bottom 0.406: C4.+ 3.94,18.29 R1.2
VCC'
  Top 0.254: TUBE.1-VDD 151,25.12 151,26.49 149.4,28.09 149.4,34.04 144.15,39.29 129.74,39.29 JP3.24